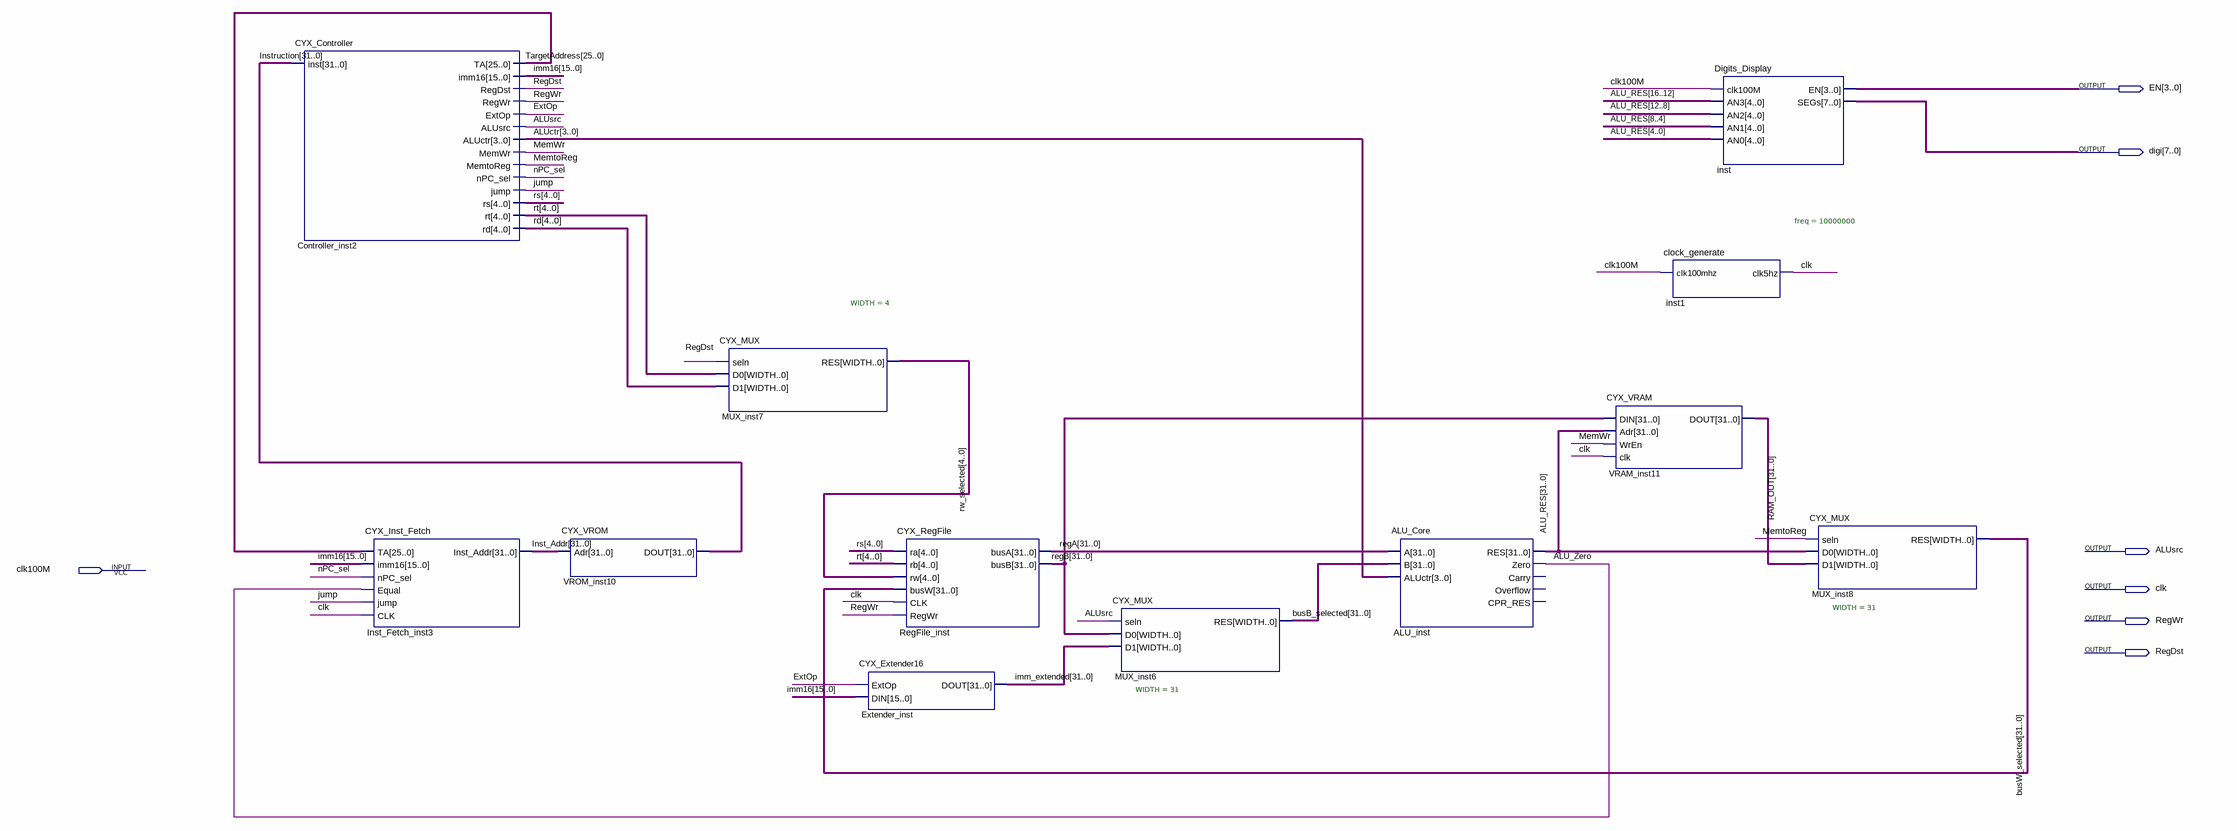
[diagram p0: schematic sheet]
// Quartus schematic CYX_SC_CPU_nanoMIPS.bdf as structural Verilog: 12 symbols, 7 pins
module CYX_SC_CPU_nanoMIPS (
  input  clk100M,
  output [3:0] EN,
  output [7:0] digi,
  output ALUsrc,
  output clk,
  output RegWr,
  output RegDst
);

  wire ALU_Zero, ExtOp, jump, MemtoReg, MemWr, nPC_sel;
  wire [3:0] ALUctr;
  wire [4:0] rd, rs, rt, rw_selected;
  wire [15:0] imm16;
  wire [25:0] TargetAddress;
  wire [31:0] ALU_RES, busB_selected, busW_selected, imm_extended, Inst_Addr, Instruction, RAM_OUT, regA,
       regB;

  CYX_Controller Controller_inst2 (
    .inst(Instruction), .TA(TargetAddress), .imm16(imm16), .RegDst(RegDst), .RegWr(RegWr), .ExtOp(ExtOp),
    .ALUsrc(ALUsrc), .ALUctr(ALUctr), .MemWr(MemWr), .MemtoReg(MemtoReg), .nPC_sel(nPC_sel), .jump(jump),
    .rs(rs), .rt(rt), .rd(rd));
  CYX_Inst_Fetch Inst_Fetch_inst3 (
    .TA(TargetAddress), .imm16(imm16), .nPC_sel(nPC_sel), .Equal(ALU_Zero), .jump(jump), .CLK(clk),
    .Inst_Addr(Inst_Addr));
  CYX_VROM VROM_inst10 (.Adr(Inst_Addr), .DOUT(Instruction));
  CYX_MUX #(.WIDTH(4)) MUX_inst7 (.seln(RegDst), .D0(rt), .D1(rd), .RES(rw_selected));
  CYX_Extender16 Extender_inst (.ExtOp(ExtOp), .DIN(imm16), .DOUT(imm_extended));
  CYX_RegFile RegFile_inst (
    .ra(rs), .rb(rt), .rw(rw_selected), .busW(busW_selected), .CLK(clk), .RegWr(RegWr), .busA(regA),
    .busB(regB));
  CYX_MUX #(.WIDTH(31)) MUX_inst6 (.seln(ALUsrc), .D0(regB), .D1(imm_extended), .RES(busB_selected));
  ALU_Core ALU_inst (
    .A(regA), .B(busB_selected), .ALUctr(ALUctr), .RES(ALU_RES), .Zero(ALU_Zero));  // open: Carry, Overflow, CPR_RES
  CYX_VRAM VRAM_inst11 (.DIN(regB), .Adr(ALU_RES), .WrEn(MemWr), .clk(clk), .DOUT(RAM_OUT));
  clock_generate #(.freq(10000000)) inst1 (.clk100mhz(clk100M), .clk5hz(clk));
  Digits_Display inst (
    .clk100M(clk100M), .AN3(ALU_RES[16:12]), .AN2(ALU_RES[12:8]), .AN1(ALU_RES[8:4]), .AN0(ALU_RES[4:0]),
    .EN(EN), .SEGs(digi));
  CYX_MUX #(.WIDTH(31)) MUX_inst8 (.seln(MemtoReg), .D0(ALU_RES), .D1(RAM_OUT), .RES(busW_selected));
endmodule
